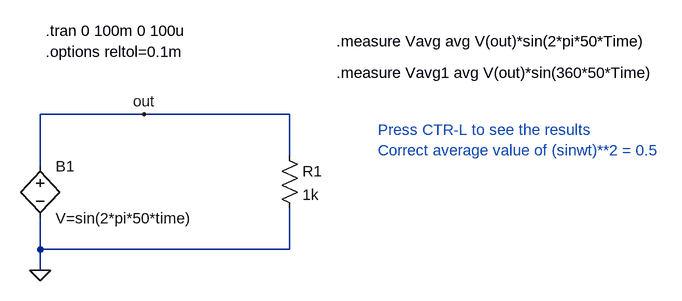
[diagram p0: schematic test-sine-function.asc]
test-sine-function.asc, the LTspice schematic file:
Version 4
SHEET 1 1124 680
WIRE 272 48 112 48
WIRE 496 48 272 48
WIRE 496 112 496 48
WIRE 112 128 112 48
WIRE 112 256 112 208
WIRE 496 256 496 192
WIRE 496 256 112 256
WIRE 112 288 112 256
FLAG 112 288 0
FLAG 272 48 out
SYMBOL bv 112 112 R0
SYMATTR InstName B1
SYMATTR Value V=sin(2*pi*50*time)
SYMBOL res 480 96 R0
SYMATTR InstName R1
SYMATTR Value 1k
TEXT 120 -80 Left 2 !.tran 0 100m 0 100u
TEXT 568 -64 Left 2 !.measure Vavg avg V(out)*sin(2*pi*50*Time)
TEXT 120 -48 Left 2 !.options reltol=0.1m
TEXT 568 -16 Left 2 !.measure Vavg1 avg V(out)*sin(360*50*Time)
TEXT 632 72 Left 2 ;Press CTR-L to see the results\nCorrect average value of (sinwt)**2 = 0.5

The netlist it stands for:
* test-sine-function.asc
B1 out 0 V=sin(2*pi*50*time)
R1 out 0 1k
.tran 0 100m 0 100u
.measure Vavg avg V(out)*sin(2*pi*50*Time)
.options reltol=0.1m
.measure Vavg1 avg V(out)*sin(360*50*Time)
* Press CTR-L to see the results
* Correct average value of (sinwt)**2 = 0.5
.backanno
.end